# Altium schematic sheet JTAG_AMC_Box.SchDoc: JTAG
size 420 x 297 mm; Author: G.Kasprowicz; CompanyName: WUT ISE; DrawnBy: G.Kasprowicz; Organization: WUT ISE; Address1: PW ISE; Address2: Nowowiejska 15/19 00-665 Warsaw; Address3: gkasprow@gmail.com; DocumentNumber: 7; Revision: 2; SheetNumber: 7; SheetTotal: 18; ModifiedBy: -; CheckedDate: -; Title2: connectors & logics; DivGrp: WUT ISE; Designer: G.Kasprowicz; ModifiedDate: -; ProjectName: Sensor Box
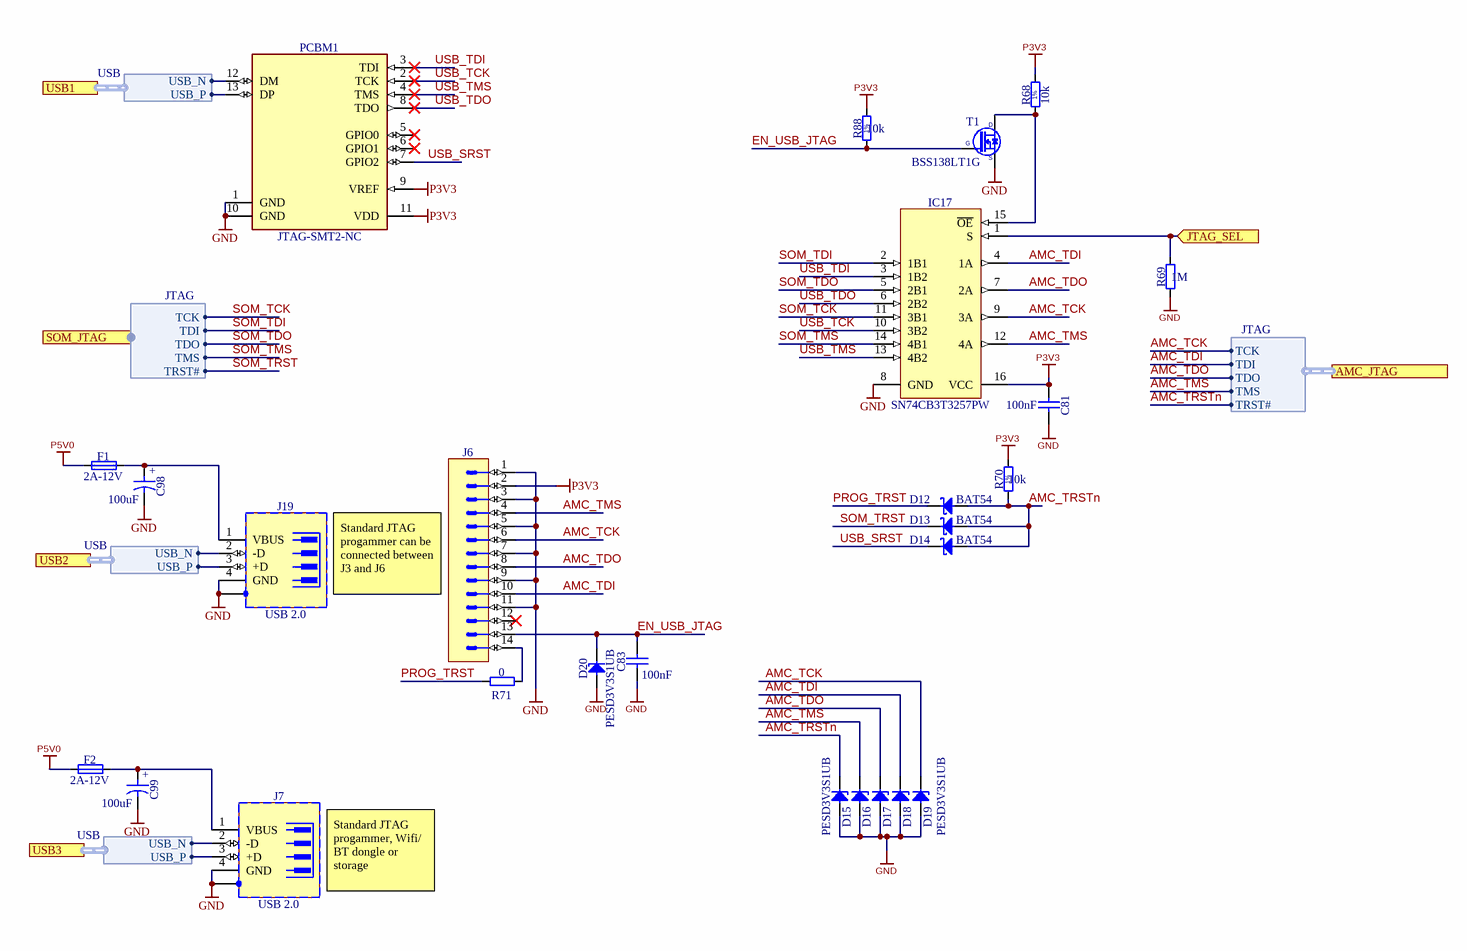
[diagram p0: JTAG_AMC_Box.SchDoc]

## Parts
C81  100nF  [CAPC0603X33N]
C83  100nF  [CAPC0603X33N]
C98  100uF  [CAPAE660X540N]
C99  100uF  [CAPAE660X540N]
D12  BAT54  [SOT95P240X130-3N]
D13  BAT54  [SOT95P240X130-3N]
D14  BAT54  [SOT95P240X130-3N]
D15  PESD3V3S1UB  [SODFL1608X65N]
D16  PESD3V3S1UB  [SODFL1608X65N]  (value not drawn)
D17  PESD3V3S1UB  [SODFL1608X65N]  (value not drawn)
D18  PESD3V3S1UB  [SODFL1608X65N]  (value not drawn)
D19  PESD3V3S1UB  [SODFL1608X65N]
D20  PESD3V3S1UB  [SODFL1608X65N]
F1  2A-12V  [FUSR_LITTELFUSE_1812L200]
F2  2A-12V  [FUSR_LITTELFUSE_1812L200]
IC17  SN74CB3T3257PW  [SOP65P640X120-16N]
J6  Milli-Grid™  [MOLEX_87832-1420]  (value not drawn)
J7  USB 2.0  [TYCO_1734366-1]
J19  USB 2.0  [TYCO_292303-1]
PCBM1  JTAG-SMT2-NC  [PCBM_DIGILENT_JTAG-SMT2-NC]
R68  10k  [RESC1005X40N]
R69  1M  [RESC1005X40N]
R70  10k  [RESC1005X40N]
R71  0  [RESC1005X40N]
R88  10k  [RESC1005X40N]
T1  BSS138LT1G  [SOT95P240X110-3N]

## Ports
AMC_JTAG (harness JTAG), JTAG_SEL (in), SOM_JTAG (harness JTAG), USB1 (harness USB), USB2 (harness USB), USB3 (harness USB)

## Harnesses
USB: USB_N, USB_P
JTAG: TCK, TMS, TDI, TDO, TRST#

## Nets
GND: C81.1 C83.1 C98.2 C99.2 D15.2(A) D16.2(A) D17.2(A) D18.2(A) D19.2(A) D20.2(A) IC17.8(GND) J6.1 J6.3 J6.5 J6.7 J6.9 J6.11 J7.4(GND) J7.5(SHIELD) J19.4(GND) J19.5(SHIELD) PCBM1.1(GND) PCBM1.10(GND) R69.1 T1.2(S)
P3V3: C81.2 IC17.16(VCC) J6.2 PCBM1.9(VREF) PCBM1.11(VDD) R68.2 R70.2 R88.2
P5V0: F1.1 F2.1
AMC_TCK: D19.1(C) IC17.9(3A) J6.6 ; port AMC_JTAG.TCK
AMC_TDI: D18.1(C) IC17.4(1A) J6.10 ; port AMC_JTAG.TDI
AMC_TDO: D17.1(C) IC17.7(2A) J6.8 ; port AMC_JTAG.TDO
AMC_TMS: D16.1(C) IC17.12(4A) J6.4 ; port AMC_JTAG.TMS
AMC_TRSTn: D12.1(A) D13.1(A) D14.1(A) D15.1(C) R70.1 ; port AMC_JTAG.TRST#
EN_USB_JTAG: C83.2 D20.1(C) J6.13 R88.1 T1.1(G)
JTAG_SEL: IC17.1(S) R69.2 ; port JTAG_SEL
PROG_TRST: D12.3(C) R71.2
SOM_TCK: IC17.11(3B1) ; port SOM_JTAG.TCK
SOM_TDI: IC17.2(1B1) ; port SOM_JTAG.TDI
SOM_TDO: IC17.5(2B1) ; port SOM_JTAG.TDO
SOM_TMS: IC17.14(4B1) ; port SOM_JTAG.TMS
SOM_TRST: D13.3(C) ; port SOM_JTAG.TRST#
USB_SRST: D14.3(C) PCBM1.7(GPIO2)
USB_TCK: IC17.10(3B2) PCBM1.2(TCK)
USB_TDI: IC17.3(1B2) PCBM1.3(TDI)
USB_TDO: IC17.6(2B2) PCBM1.8(TDO)
USB_TMS: IC17.13(4B2) PCBM1.4(TMS)
NetC98_1: C98.1 F1.2 J19.1(VBUS)
NetC99_1: C99.1 F2.2 J7.1(VBUS)
NetIC17_15: IC17.15(~{OE}) R68.1 T1.3(D)
NetJ6_14: J6.14 R71.1
NetJ7_2: J7.2(-D) ; port USB3.USB_N
NetJ7_3: J7.3(+D) ; port USB3.USB_P
NetJ19_2: J19.2(-D) ; port USB2.USB_N
NetJ19_3: J19.3(+D) ; port USB2.USB_P
NetPCBM1_12: PCBM1.12(DM) ; port USB1.USB_N
NetPCBM1_13: PCBM1.13(DP) ; port USB1.USB_P

Not connected (* = marked no-connect by the designer): J6 12*; PCBM1 5(GPIO0)* 6(GPIO1)*

## Notes on the sheet
- (near J6) Standard JTAG progammer can be connected between J3 and J6
- Standard JTAG progammer, Wifi/ BT dongle or storage
- Project/Equipment
- Document
- Designer
- Drawn by
- Check.by
- Copyright WUT ISE 2020.
  This documentation describes Open Hardware and is licensed under the CERN OHL v.1.2. You may redistribute and modify this documentation under the terms of the CERN OHL v.1.2. (http://ohwr.org/CERNOHL). This documentation is distributed WITHOUT ANY EXPRESS OR IMPLIED WARRANTY, INCLUDING OF MERCHANTABILITY, SATISFACTORY QUALITY AND FITNESS FOR A PARTICULAR PURPOSE. Please see the CERN OHL v.1.2 for applicable conditions.
- Contact
- File
- Last Mod.
- Print Date
- Sheet
- Size
- A3
- of
- Rev
- (in symbol CAE660-540_100UF_16V_20%) +
- (in symbol R0402_10K_1%_0.0625W_100PPM) 1%

## Library data of the parts
C81 C83 = CC0201_100NF_6.3V_10%_X5R: Non-polarised capacitor; Manufacturer: GENERIC; Part Description: SMD Multilayer Chip Ceramic Capacitor; Manufacturer1 Part Number: 02016D104KAT2A; Tolerance: ±10%; Voltage: 6.3V; TC: X5R; Manufacturer Part Number: CC0201_100NF_6.3V_10%_X5R; Part Number: CC0201_100NF_6.3V_10%_X5R; Value: 100nF; Component Kind: Standard; Component Type: Standard; Pin Count: 2; Status: Not Recommended; Case: 0201; Mounted: Yes; Socket: No; SMD: Yes; Sense: No; Manufacturer1 Example: AVX; Manufacturer1 ComponentHeight: 0.33mm; HelpURL: \\cern.ch\dfs\Applications\Altium\Datasheets\CC0201_X5R_AVX.pdf; Author: CERN DEM JLC; CreateDate: 03.12.2007; LatestRevisionDate: 03.12.2007
C98 C99 = CAE660-540_100UF_16V_20%: Polarised capacitor; Part Description: Aluminum Electrolytic SMT Capacitor; Manufacturer: PANASONIC; Manufacturer Part Number: EEEFK1C101AP; Voltage: 16V; Tolerance: ±20%; Part Number: CAE660-540_100UF_16V_20%; Component Kind: Standard; Component Type: Standard; Pin Count: 2; Value: 100uF; Status: Not Recommended; Case: D; Mounted: Yes; Socket: No; SMD: Yes; Sense: No; ComponentHeight: 5.8mm; HelpURL: \\cern.ch\dfs\Applications\Altium\Datasheets\CAE_PANASONIC_FK.pdf; Author: CERN DEM JLC; CreateDate: 03.12.2007; LatestRevisionDate: 05.11.2014
D12-D14 = BAT54: Diode Schottky  Anode Pin 1 Cathode Pin 3 (Pas de pin 2); Part Description: Single Small Signal Schottky Diode; Manufacturer: FAIRCHILD SEMICONDUCTOR; Voltage: 30V; Power: 200mA; Table: Diodes; Part Number: BAT54; Component Kind: Standard; Component Type: Standard; Device: BAT54; PackageDescription: SOT23 3-Leads, Pitch 0.95mm - Body 1.3x2.9mm, IPC Medium Density; Manufacturer Part Number: BAT54; Pin Count: 3; Case: SOT23-3; Mounted: Yes; Socket: No; SMD: Yes; ComponentHeight: 1.30mm; HelpURL: \\cern.ch\dfs\Applications\Altium\Datasheets\BAT54.pdf; Author: CERN DEM JLC; CreateDate: 2009-09-17; LatestRevisionDate: 2010-05-27
D15-D20 = PESD3V3S1UB: ESD protection diode; Manufacturer Part Number: ESD8351XV2T1G; Manufacturer: NXP SEMICONDUCTORS; Part Description: ESD protection diode (23kV); Voltage: 3V3; Power: 330W; PressFit: No; Bonding: No; PackageDescription: Ultra Small Outline Diode Flat Lead (SOD-523), Body; 1.2mm L X 0.8mm W X 0.65mm H, IPC Medium Density; Part Number: PESD3V3S1UB; Component Kind: Standard; Component Type: Standard; Device: PESD3V3S1UB; Pin Count: 2; Case: SOD523; Mounted: Yes; Socket: No; SMD: Yes; Sense: No; ComponentHeight: 0.65mm; HelpURL: \\cern.ch\dfs\Applications\Altium\Datasheets\PESD3V3S1UB.pdf; Author: CERN DEM JLC; CreateDate: 29.11.2012; LatestRevisionDate: 29.11.2012
F1 F2 = FUSR1812_LITTELFUSE_1812L200/12: Fuse; Part Description: POLYFUSE® Surface Mount Resettable PTC; Manufacturer Part Number: 1812L200/12DR; PressFit: No; Part Number: FUSR1812_LITTELFUSE_1812L200/12; Component Kind: Standard; Component Type: Standard; Pin Count: 2; PackageDescription: Surface Mount POLY-FUSE® Resettable PTC, Body 4.55x3.24mm, 1812L Series; Family: Fuses Resettable; Mounted: Yes; Socket: No; SMD: Yes; Sense: No; Value: 2A-12V; Manufacturer: LITTELFUSE; ComponentHeight: 1.2mm; HelpURL: \\cern.ch\dfs\Applications\Altium\Datasheets\FUSR_LITTELFUSE_1812L.pdf; Author: CERN DEM BC; CreateDate: 23.03.2021; LatestRevisionDate: 23.03.2021
IC17 = SN74CB3T3257PW: 4-BIT 1-OF-2 FET Multiplexer/Demultiplexer 2.5V/3.3V Low-Voltage Bus Switch 5V Tolerant Shifter; Manufacturer: TEXAS INSTRUMENTS; PressFit: No; Bonding: No; Manufacturer Part Number: SN74CB3T3257PW; PackageDescription: SOP, 0.65mm pitch; 16 pin, 4.40mm W X 5.00mm L X 1.20mm H body IPC Medium Density; Part Description: 4-Bit 1-of-2 FET Multiplexer/Demultiplexer 2.5V/3.3V Low-Voltage Bus Switch 5V Tolerant Shifter; Part Number: SN74CB3T3257PW; Component Kind: Standard; Component Type: Standard; Device: SN74CB3T3257PW; Pin Count: 16; Case: TSSOP16; Mounted: Yes; Socket: No; SMD: Yes; Sense: No; ComponentHeight: 1.2mm; Author: CERN DEM JLC; HelpURL: \\cern.ch\dfs\Applications\Altium\Datasheets\SN74CB3T3257PW.pdf; CreateDate: 30.01.2012; LatestRevisionDate: 30.01.2012
J6 = MOLEX_87832-1420: Connector 14 Male; Part Description: 2.00mm (.079") Pitch Milli-Grid™ Header, Surface Mount, Vertical, Shrouded, 14 Circuits,with Locking Windows and Centre Polarization Slot, PCB Locator; Manufacturer: MOLEX; Part Number: MOLEX_87832-1420; Component Kind: Standard; Component Type: Standard; Pin Count: 14; Family: Milli-Grid™; Mounted: Yes; Socket: No; SMD: Yes; Status: None; Manufacturer Part Number: 87832-1420; ComponentHeight: 6.4mm; HelpURL: \\cern.ch\dfs\Applications\Altium\Datasheets\MOLEX_87832-1420.pdf; Author: CERN DEM JLC; CreateDate: 2008-09-09; LatestRevisionDate: 2008-09-09; Table: MOLEX
J7 = TYCO_1734366-1: 4 Pin + 1 Shield USB Receptacle; Part Description: 4 Position, Straight, USB 2.0 Type A Receptacle; Manufacturer: TYCO ELECTRONICS; PressFit: No; Part Number: TYCO_1734366-1; Component Kind: Standard; Component Type: Standard; Pin Count: 6; Family: USB 2.0; Mounted: Yes; Socket: No; SMD: No; Sense: No; Status: None; Manufacturer Part Number: 1734366-1; ComponentHeight: 15mm; HelpURL: \\cern.ch\dfs\Applications\Altium\Datasheets\TYCO_1734366-1.pdf; Author: CERN DEM MR; CreateDate: 30.05.2016; LatestRevisionDate: 30.05.2016
J19 = TYCO_292303-1: 4 Pin + 1 Shield USB Receptacle; Part Description: 4 Positions, Right Angle, USB 2.0 Type A Receptacle; Manufacturer: TYCO ELECTRONICS; PressFit: No; Part Number: TYCO_292303-1; Component Kind: Standard; Component Type: Standard; Pin Count: 5; Family: USB 2.0; Mounted: Yes; Socket: No; SMD: No; Sense: No; Status: None; Manufacturer Part Number: 292303-1; ComponentHeight: 7.65mm; HelpURL: \\cern.ch\dfs\Applications\Altium\Datasheets\TYCO_292303-1.pdf; Author: CERN DEM JMW; CreateDate: 13.08.2015; LatestRevisionDate: 13.08.2015
PCBM1 = PCBM_DIGILENT_JTAG-SMT2-NC: Programming Module for Xilinx FPGAs; Part Description: Programming Module for Xilinx® FPGAs; PressFit: No; Bonding: No; Part Number: PCBM_DIGILENT_JTAG-SMT2; Component Kind: Standard; Component Type: Standard; Device: JTAG-SMT2-NC; PackageDescription: JTAG-SMT2 Case, 5.00mm Pitch; 11 Pins, 22.75mm W X 21.5mm L X 3.00mm H body; Manufacturer: DIGILENT; Manufacturer Part Number: JTAG-SMT2-NC; Pin Count: 11; Mounted: Yes; Socket: No; SMD: Yes; Sense: No; ComponentHeight: 12.55mm; Author: GK; HelpURL: \\cern.ch\dfs\Applications\Altium\Datasheets\PCBM_DIGILENT_JTAG-SMT2.pdf; CreateDate: 27.05.2021; LatestRevisionDate: 27.05.2021
R68 R70 R88 = R0402_10K_1%_0.0625W_100PPM: Resistor - 1%; Manufacturer: GENERIC; Part Description: General Purpose Thick Film Chip Resistor; Manufacturer1 Part Number: 232270671003L; TC: ±100ppm/°C; PressFit: No; Manufacturer Part Number: R0402_10K_1%_0.0625W_100PPM; Part Number: R0402_10K_1%_0.0625W_100PPM; Tolerance: ±1%; Value: 10k; Component Kind: Standard; Component Type: Standard; Pin Count: 2; Status: Not Recommended; Power: 0.0625W; Case: 0402; Mounted: Yes; Sense: No; Socket: No; SMD: Yes; Manufacturer1 Example: YAGEO PHYCOMP; Manufacturer1 ComponentHeight: 0.4mm; HelpURL: \\cern.ch\dfs\Applications\Altium\Datasheets\R0402_Phycomp_RC0402.pdf; Author: CERN DEM JLC; CreateDate: 03.12.2007; LatestRevisionDate: 17.10.2012
R69 = R0402_1M_1%_0.0625W_100PPM: Resistor - 1%; Manufacturer: GENERIC; Part Description: General Purpose Thick Film Chip Resistor; Manufacturer1 Part Number: 232270671005L; TC: ±100ppm/°C; PressFit: No; Manufacturer Part Number: R0402_1M_1%_0.0625W_100PPM; Part Number: R0402_1M_1%_0.0625W_100PPM; Tolerance: ±1%; Value: 1M; Component Kind: Standard; Component Type: Standard; Pin Count: 2; Status: Not Recommended; Power: 0.0625W; Case: 0402; Mounted: Yes; Sense: No; Socket: No; SMD: Yes; Manufacturer1 Example: YAGEO PHYCOMP; Manufacturer1 ComponentHeight: 0.4mm; HelpURL: \\cern.ch\dfs\Applications\Altium\Datasheets\R0402_Phycomp_RC0402.pdf; Author: CERN DEM JLC; CreateDate: 03.12.2007; LatestRevisionDate: 17.10.2012
R71 = R0402_0R_JUMPER: Resistor; Manufacturer: GENERIC; Part Description: 1A (0.05R Max DC Resistance) Zero Ohm Jumper; Manufacturer1 Part Number: 232270591001L; PressFit: No; Manufacturer Part Number: R0402_0R_JUMPER; Part Number: R0402_0R_JUMPER; Value: 0; Component Kind: Standard; Component Type: Standard; Pin Count: 2; Status: Not Recommended; Case: 0402; Mounted: Yes; Sense: No; Socket: No; SMD: Yes; Manufacturer1 Example: YAGEO PHYCOMP; Manufacturer1 ComponentHeight: 0.4mm; HelpURL: \\cern.ch\dfs\Applications\Altium\Datasheets\R0402_Phycomp_RC0402.pdf; Author: CERN DEM JLC; CreateDate: 03.12.2007; LatestRevisionDate: 17.10.2012
T1 = BSS138LT1G: N-CHANNEL MOSFET WITH DIODE; Manufacturer: ON SEMICONDUCTOR; Part Description: 50V 200mA N-Channel Enhancement Mode Field-Effect Transistor; PressFit: No; Bonding: No; Manufacturer Part Number: BSS138LT1G; PackageDescription: SOT23 3-Leads, Pitch 0.95mm - Body 1.4x3mm, IPC Medium Density; Part Number: BSS138LT1G; Component Kind: Standard; Component Type: Standard; Device: BSS138LT1G; Pin Count: 3; Case: SOT23-3; Mounted: Yes; Socket: No; SMD: Yes; Sense: No; ComponentHeight: 1.11mm; HelpURL: \\cern.ch\dfs\Applications\Altium\Datasheets\BSS138LT1G.pdf; Author: CERN DEM JLC; CreateDate: 23.03.2009; LatestRevisionDate: 23.03.2009